# EAGLE design working (EAGLE 9.4.1)
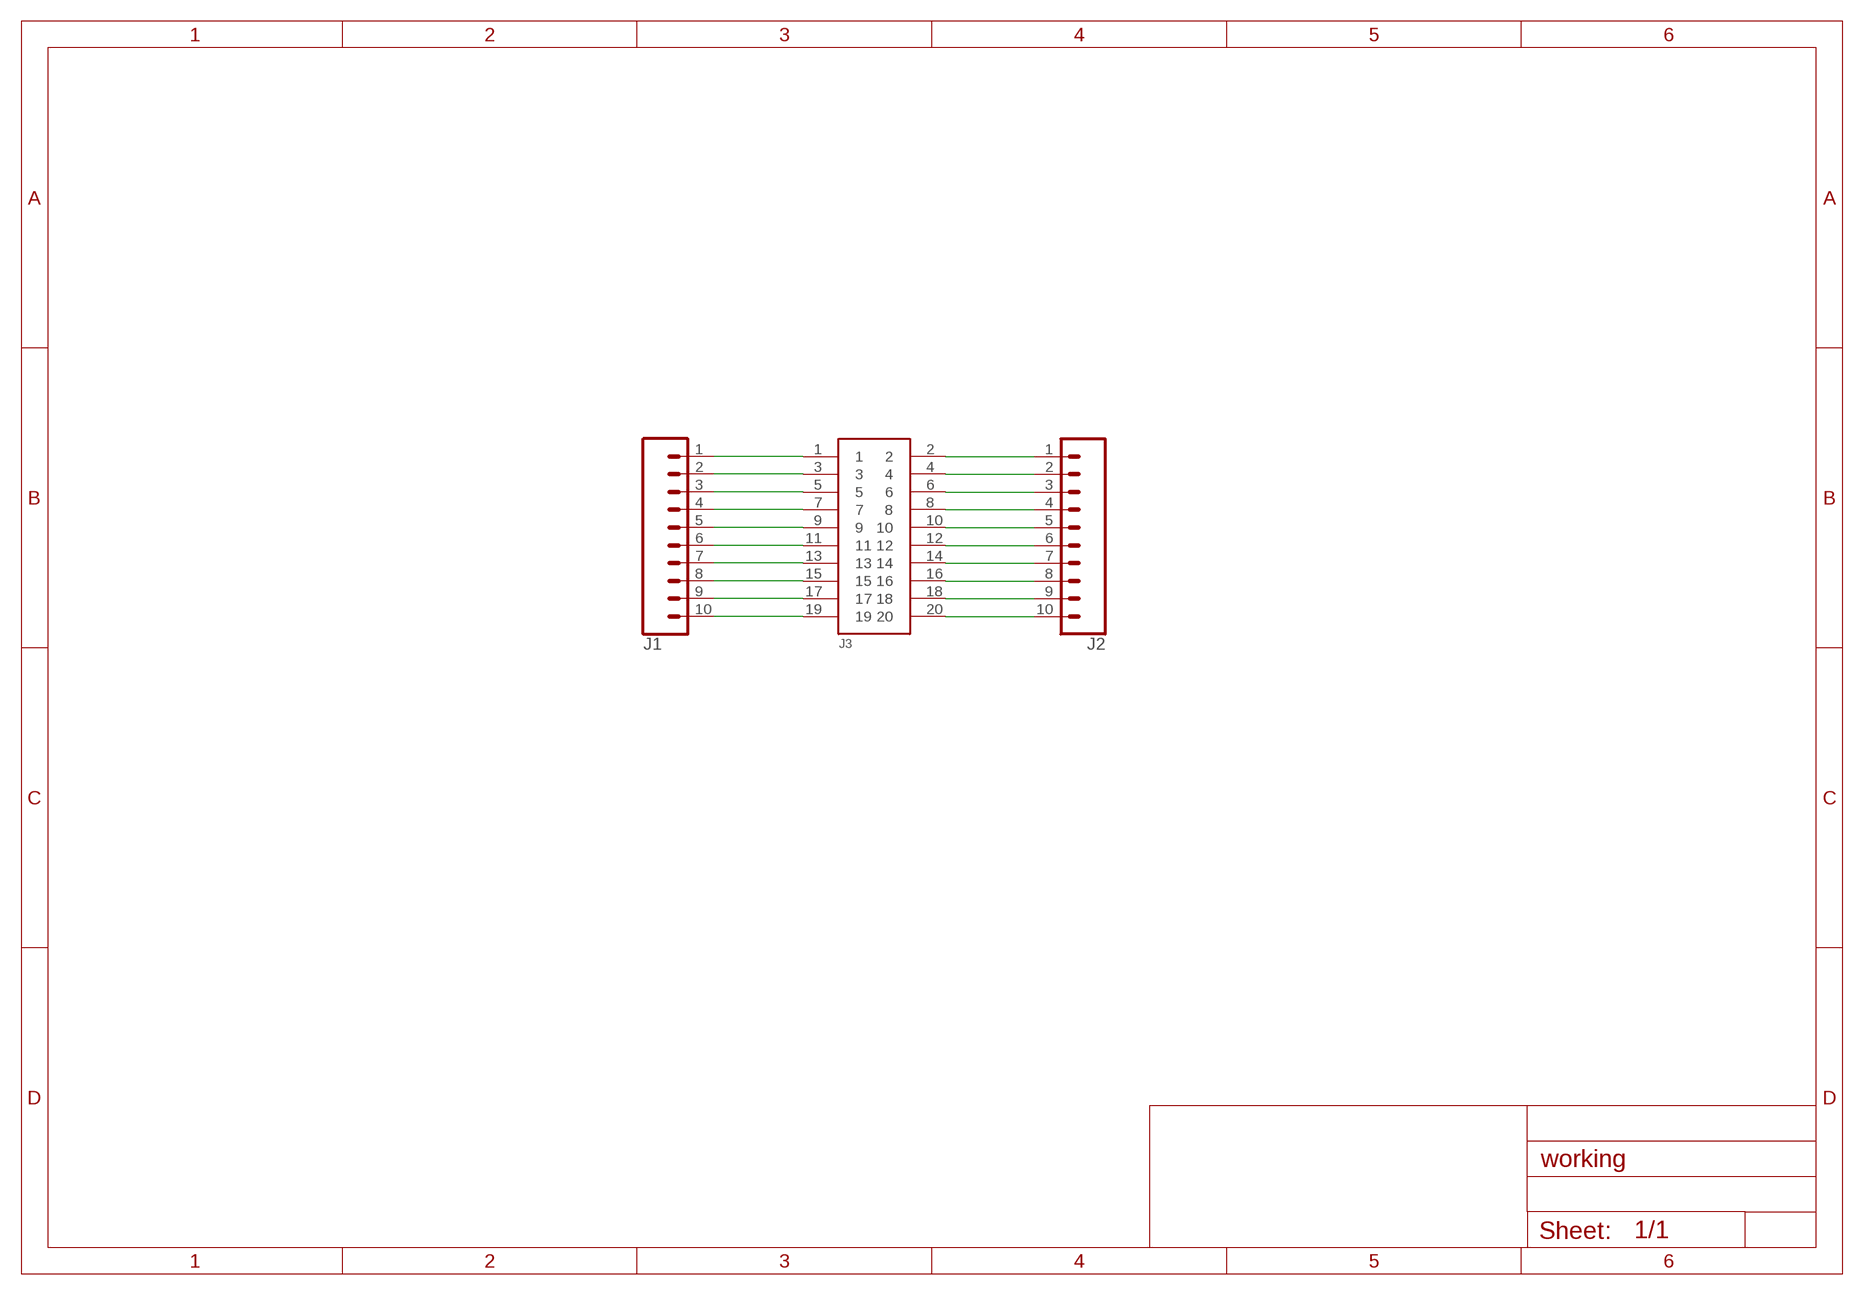
[diagram p0: schematic, sheet 1]

## Parts
J1  CONN_10"  [1X10]
J2  CONN_10"  [1X10]
J3  ST4-10-X.XX-X-D  [ST4-10-X.XX-X-D]

## Nets
N$1: J1.1 J3.1
N$2: J2.1 J3.2
N$3: J1.2 J3.3
N$4: J2.2 J3.4
N$5: J1.3 J3.5
N$6: J2.3 J3.6
N$7: J1.4 J3.7
N$8: J2.4 J3.8
N$9: J1.5 J3.9
N$10: J2.5 J3.10
N$11: J1.6 J3.11
N$12: J2.6 J3.12
N$13: J1.7 J3.13
N$14: J2.7 J3.14
N$15: J1.8 J3.15
N$16: J2.8 J3.16
N$17: J1.9 J3.17
N$18: J2.9 J3.18
N$19: J1.10 J3.19
N$20: J2.10 J3.20

## Library data of the parts
J1 J2 = SparkFun-Connectors:CONN_10: Multi connection point. Often used as Generic Header-pin footprint for 0.1 inch spaced/style header connections On any of the 0.1 inch spaced packages, you can populate with these: Break Away Headers - Straight <https://www.sparkfun.com/products/116> (PRT-00116) Break Away Male Headers - Right Angle <https://www.sparkfun.com/products/553> (PRT-00553) Female Headers <https://www.sparkfun.com/products/115> (PRT-00115) Break Away Headers - Machine Pin <https://www.sparkfun.com/products/117> (PRT-00117) Break Away Female Headers - Swiss Machine Pin <https://www.sparkfun.com/products/743> (PRT-00743) Arduino Stackable Header - 10 Pin <https://www.sparkfun.com/products/11376> (PRT-11376) For SCREWTERMINALS and SPRING TERMINALS visit here: Screw Terimnals on SparkFun.com <https://www.sparkfun.com/search/results?term=Screw+Terminals> (5mm/3.5mm/2.54mm spacing) This device is also useful as a general connection point to wire up your design to another part of your project. Our various solder wires solder well into these plated through hole pads. Hook-Up Wire - Assortment (Stranded, 22 AWG) <https://www.sparkfun.com/products/11375> (PRT-11375) Hook-Up Wire - Assortment (Solid Core, 22 AWG) <https://www.sparkfun.com/products/11367> (PRT-11367) View the entire wire category on our website here <https://www.sparkfun.com/categories/141> Special notes: Molex polarized connector foot print use with SKU : PRT-08231 with associated crimp pins and housings. 1MM SMD Version SKU: PRT-10208 NOTES ON THE VARIANTS LOCK and LOCK_LONGPADS... This footprint was designed to help hold the alignment of a through-hole component (i.e. 6-pin header) while soldering it into place. You may notice that each hole has been shifted either up or down by 0.005 of an inch from it's more standard position (which is a perfectly straight line). This slight alteration caused the pins (the squares in the middle) to touch the edges of the holes. Because they are alternating, it causes a "brace" to hold the component in place. 0.005 has proven to be the perfect amount of "off-center" position when using our standard breakaway headers. Although looks a little odd when you look at the bare footprint, once you have a header in there, the alteration is very hard to notice. Also,if you push a header all the way into place, it is covered up entirely on the bottom side.; PROD_ID: CONN-11563
J3 = ST4-30-X.XX-X-D:ST4-10-X.XX-X-D: 0.4MM TERMINAL STRIP ASSEMBLY.

## Board
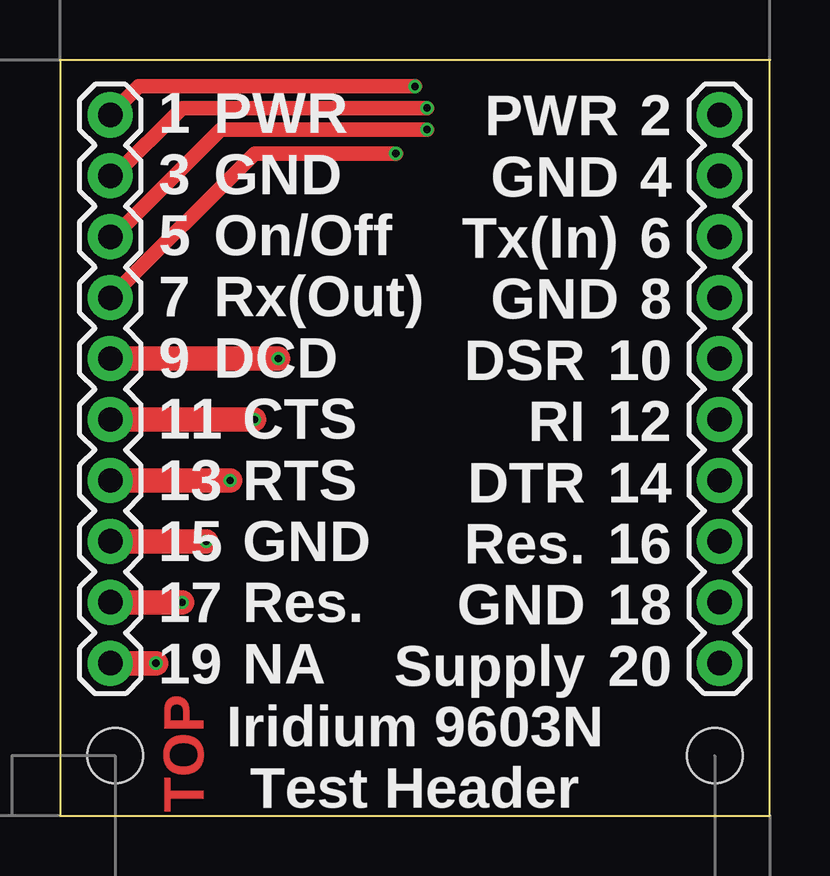
[diagram p1: board, top side]
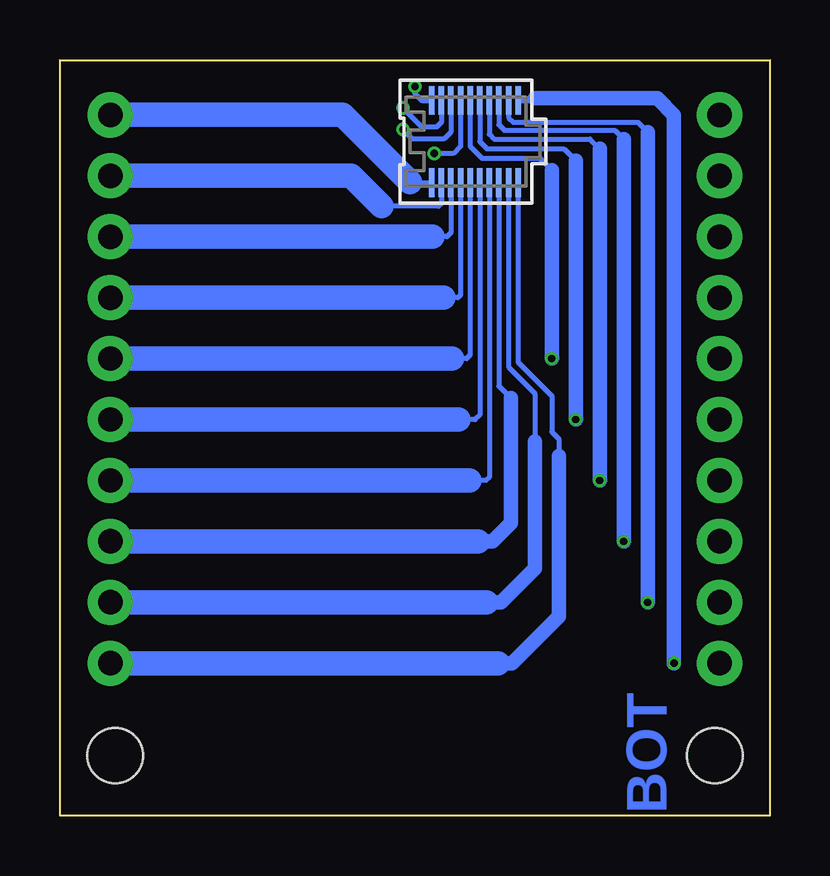
[diagram p2: board, bottom side, seen from below]

Size 29.6 x 31.5 mm. Coordinates in mm from the lower left corner, seen from the top.
Outline: 0,0 29.6,0 29.6,31.5 0,31.5 0,0
Copper layers (1*16): Top 0.018mm / dielectric 1.55mm / Bottom 0.018mm
Design rules "Multi-CB_2L_125um-Tracks_OL35um": minimum track width 0.125mm, minimum drill 0.2mm, track to track 0.125mm, track to pad 0.125mm, pad to pad 0.125mm, via to via 0.125mm, smd to smd 0mil, copper to edge 0.2mm, drill to drill 0.2mm, minimum pad ring 0.125mm, minimum via ring 0.125mm, stop-mask expansion 2mil, vias tented up to drill 0.45mm, thermal gap 0.2mm
Holes 2.3 mm at 2.3,2.5 27.3,2.5

### Footprints (pad centres in the part's own frame; a part is rotated, then mirrored left to right if it is on the bottom)
1X10 = drill 1.016 pad 1.88: 1 0,0; 2 2.54,0; 3 5.08,0; 4 7.62,0; 5 10.16,0; 6 12.7,0; 7 15.24,0; 8 17.78,0; 9 20.32,0; 10 22.86,0
ST4-10-X.XX-X-D = smd 0.23 x 1.2: 1 -1.8,1.71; 2 -1.8,-1.71; 3 -1.4,1.71; 4 -1.4,-1.71; 5 -1,1.71; 6 -1,-1.71; 7 -0.6,1.71; 8 -0.6,-1.71; 9 -0.2,1.71; 10 -0.2,-1.71; 11 0.2,1.71; 12 0.2,-1.71; 13 0.6,1.71; 14 0.6,-1.71; 15 1,1.71; 16 1,-1.71; 17 1.4,1.71; 18 1.4,-1.71; 19 1.8,1.71; 20 1.8,-1.71

### Placement (x,y rotation side)
J1  2.1,29.21 270 top
J2  27.5,29.21 270 top
J3  12.3,28.1 0 bottom

### Tracks (layer width: path | path; a pad name or v marks a point on that pad's centre or on a via)
N$1  (via drill 0.3)
  Top 0.61: J1.1 3.29,30.4 v14.8,30.4
  Bottom 0.203: v14.8,30.4 14.8,30.1 14.51,29.81 J3.1
N$2
  Bottom 0.2: 15,26.4 15.09,26.39
  Bottom 0.203: 15.09,26.39 J3.2
  Bottom 1.016: J2.1 17.81,29.21 15,26.4
N$3  (via drill 0.3)
  Top 0.61: v15.3,29.5 5.1,29.5 2.27,26.67 J1.2
  Bottom 0.203: J3.3 13.7,28.9 13.9,28.7 14.5,28.7 v15.3,29.5
N$4
  Bottom 0.203: J3.4 13.7,25.5 13.8,25.4 16.2,25.4
  Bottom 1.016: J2.2 17.47,26.67 16.2,25.4
N$5  (via drill 0.3)
  Top 0.61: v15.3,28.6 6.7,28.6 2.23,24.13 J1.3
  Bottom 0.203: v15.3,28.6 14.9,28.2 13.6,28.2 13.3,28.5 J3.5
N$6
  Bottom 0.203: J3.6 13.3,24.3 13.47,24.13 14.07,24.13
  Bottom 1.016: 14.07,24.13 J2.3
N$7  (via drill 0.3)
  Top 0.61: v14,27.6 8.11,27.6 J1.4
  Bottom 0.203: J3.7 12.9,27.9 13.2,27.6 v14,27.6
N$8
  Bottom 0.203: J3.8 12.9,21.7 13.01,21.59 13.61,21.59
  Bottom 1.016: 13.61,21.59 J2.4
N$9  (via drill 0.3)
  Top 1.016: J1.5 v9.1,19.05
  Bottom 0.203: J3.9 12.5,27.9 12,27.4 9.6,27.4 9.1,26.9
  Bottom 0.61: 9.1,26.9 v9.1,19.05
N$10
  Bottom 0.203: J3.10 12.5,19.2 12.65,19.05 13.25,19.05
  Bottom 1.016: J2.5 13.25,19.05
N$11  (via drill 0.3)
  Top 1.016: J1.6 v8.1,16.51
  Bottom 0.203: J3.11 12.1,28.1 11.8,27.8 8.6,27.8 8.1,27.3
  Bottom 0.61: 8.1,27.3 v8.1,16.51
N$12
  Bottom 0.203: J3.12 12.1,16.7 12.29,16.51 12.99,16.51
  Bottom 1.016: J2.6 12.99,16.51
N$13  (via drill 0.3)
  Top 1.016: J1.7 v7.1,13.97
  Bottom 0.203: J3.13 11.7,28.4 11.5,28.2 7.5,28.2 7.1,27.8
  Bottom 0.61: 7.1,27.8 v7.1,13.97
N$14
  Bottom 0.203: J3.14 11.7,14.1 11.83,13.97 12.53,13.97
  Bottom 1.016: 12.53,13.97 J2.7
N$15  (via drill 0.3)
  Top 1.016: J1.8 v6.1,11.43
  Bottom 0.203: J3.15 11.3,28.8 11.07,28.57 6.47,28.57 6.1,28.2
  Bottom 0.61: 6.1,28.2 v6.1,11.43
N$16
  Bottom 0.203: J3.16 11.3,17.9 10.8,17.4
  Bottom 0.61: 10.8,17.4 10.8,12.2 11.57,11.43 12.17,11.43
  Bottom 1.016: 12.17,11.43 J2.8
N$17  (via drill 0.3)
  Top 1.016: J1.9 v5.1,8.89
  Bottom 0.203: J3.17 10.9,29.1 10.7,28.9 5.5,28.9 5.1,28.5
  Bottom 0.61: 5.1,28.5 v5.1,8.89
N$18
  Bottom 0.203: J3.18 10.9,18.7 9.8,17.6 9.8,15.6
  Bottom 0.61: 9.8,15.6 9.8,10.3 11.21,8.89 11.81,8.89
  Bottom 1.016: 11.81,8.89 J2.9
N$19  (via drill 0.3)
  Top 1.016: J1.10 v4,6.35
  Bottom 0.203: J3.19 9.89,29.81 9.8,29.9
  Bottom 0.61: 9.8,29.9 4.7,29.9 4,29.2 v4,6.35
N$20
  Bottom 0.203: J3.20 10.5,18.9 9.1,17.5 9.1,16 8.8,15.7 8.8,15
  Bottom 0.61: 8.8,15 8.8,8.3 10.75,6.35 11.35,6.35
  Bottom 1.016: 11.35,6.35 J2.10

### Text on the board
Top: TOP
Bottom: BOT
tNames: 1 / 3 / 5 / 7 / 9 / 11 / 13 / 15 / 17 / 19 | PWR / GND / On/Off / Rx(Out) / DCD | CTS / RTS / GND / Res. / NA | DSR / RI / DTR / Res. / GND / Supply | PWR / GND / Tx(In) / GND | 2 / 4 / 6 / 8 / 10 / 12 / 14 / 16 / 18 / 20 | Iridium 9603N / Test Header